# EAGLE design PS2 to UART revB (EAGLE 7.2.0)
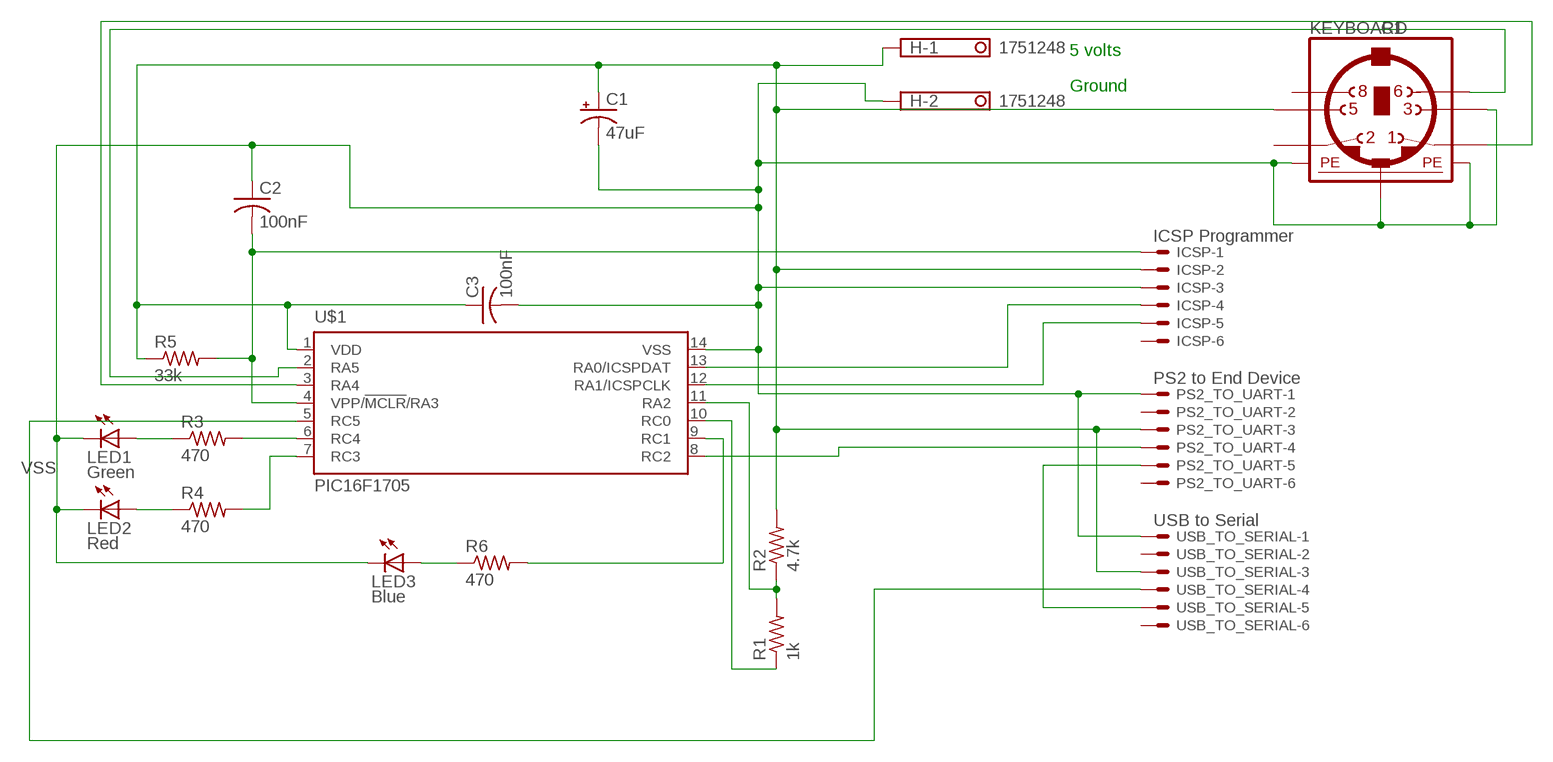
[diagram p0: schematic, sheet 1]

## Parts
C1  47uF  CPOL-USE2.5-7  [E2,5-7]
C2  100nF  C-US025-030X050  [C025-030X050]
C3  100nF  C-US025-030X050  [C025-030X050]
H  1751248  [1751248]
ICSP  ICSP Programmer  22-23-2061  [22-23-2061]
KEYBOARD  C1  MINI_DIN_6  [M_DIN6]
LED1  Green  LED5MM  [LED5MM]
LED2  Red  LED5MM  [LED5MM]
LED3  Blue  LED5MM  [LED5MM]
PS2_TO_UART  PS2 to End Device  22-23-2061  [22-23-2061]
R1  1k  R-US_0207/10  [0207/10]
R2  4.7k  R-US_0207/10  [0207/10]
R3  470  R-US_0207/10  [0207/10]
R4  470  R-US_0207/10  [0207/10]
R5  33k  R-US_0207/12  [0207/12]
R6  470  R-US_0207/10  [0207/10]
U$1  PIC16F1705  [SO-14]
USB_TO_SERIAL  USB to Serial  22-23-2061  [22-23-2061]

## Nets
N$1: R1.2 R2.1 U$1.11(RA2)
N$2: R1.1 U$1.10(RC0)
N$3: R3.2 U$1.6(RC4)
N$4: R4.2 U$1.7(RC3)
N$5: LED1.A R3.1
N$6: LED2.A R4.1
N$7: U$1.5(RC5) USB_TO_SERIAL.4
N$8: PS2_TO_UART.4 U$1.8(RC2)
N$9: C2.2 ICSP.1 R5.2 U$1.4(VPP/!MCLR!/RA3)
N$10: ICSP.4 U$1.13(RA0/ICSPDAT)
N$11: ICSP.5 U$1.12(RA1/ICSPCLK)
N$12: PS2_TO_UART.5 USB_TO_SERIAL.5
N$14: LED3.A R6.1
N$15: R6.2 U$1.9(RC1)
N$16: KEYBOARD.1 U$1.3(RA4)
N$17: KEYBOARD.6 U$1.2(RA5)
VDD: C1.+ C3.1 H.1 ICSP.2 KEYBOARD.5 PS2_TO_UART.3 R2.2 R5.1 U$1.1(VDD) USB_TO_SERIAL.3
VSS: C1.- C2.1 C3.2 H.2 ICSP.3 KEYBOARD.3 KEYBOARD.SH1(PE1) KEYBOARD.SH2(PE2) KEYBOARD.SH3(PE3) LED1.K(C) LED2.K(C) LED3.K(C) PS2_TO_UART.1 U$1.14(VSS) USB_TO_SERIAL.1
Unconnected: ICSP.6 KEYBOARD.2 KEYBOARD.8 PS2_TO_UART.2 PS2_TO_UART.6 USB_TO_SERIAL.2 USB_TO_SERIAL.6

## Notes on the sheet
- 5 volts
- Ground

## Library data of the parts
C1 = rcl:CPOL-US: POLARIZED CAPACITOR, American symbol
C2 C3 = rcl:C-US: CAPACITOR, American symbol
H = con-phoenix-350:1751248: MKDS 1/ 2-3,5 Printklemme Nennstrom: 10 A Bemessungsspannung: 160 V Raster: 3,5 mm Polzahl: 2 Montageart: Löten Anschlussart: Schraubanschluss Anschlussrichtung vom Leiter zur Platine: 0° Source: http://eshop.phoenixcontact.com .. 1751248.pdf; OC_FARNELL: unknown; OC_NEWARK: unknown
ICSP PS2_TO_UART USB_TO_SERIAL = con-molex:22-23-2061: .100" (2.54mm) Center Header - 6 Pin; MF: MOLEX; MPN: 22-23-2061; OC_FARNELL: 1462922; OC_NEWARK: 27C1933
KEYBOARD = mini_din:MINI_DIN_6
LED1-LED3 = led:LED: LED OSRAM: - CHIPLED LG R971, LG N971, LY N971, LG Q971, LY Q971, LO R971, LY R971 LH N974, LH R974 LS Q976, LO Q976, LY Q976 LO Q996 - Hyper CHIPLED LW Q18S LB Q993, LB Q99A, LB R99A - SideLED LS A670, LO A670, LY A670, LG A670, LP A670 LB A673, LV A673, LT A673, LW A673 LH A674 LY A675 LS A676, LA A676, LO A676, LY A676, LW A676 LS A679, LY A679, LG A679 - Hyper Micro SIDELED® LS Y876, LA Y876, LO Y876, LY Y876 LT Y87S - SmartLED LW L88C, LW L88S LB L89C, LB L89S, LG L890 LS L89K, LO L89K, LY L89K LS L896, LA L896, LO L896, LY L896 - TOPLED LS T670, LO T670, LY T670, LG T670, LP T670 LSG T670, LSP T670, LSY T670, LOP T670, LYG T670 LG T671, LOG T671, LSG T671 LB T673, LV T673, LT T673, LW T673 LH T674 LS T676, LA T676, LO T676, LY T676, LB T676, LH T676, LSB T676, LW T676 LB T67C, LV T67C, LT T67C, LS T67K, LO T67K, LY T67K, LW E67C LS E67B, LA E67B, LO E67B, LY E67B, LB E67C, LV E67C, LT E67C LW T67C LS T679, LY T679, LG T679 LS T770, LO T770, LY T770, LG T770, LP T770 LB T773, LV T773, LT T773, LW T773 LH T774 LS E675, LA E675, LY E675, LS T675 LS T776, LA T776, LO T776, LY T776, LB T776 LHGB T686 LT T68C, LB T68C - Hyper Mini TOPLED® LB M676 - Mini TOPLED Santana® LG M470 LS M47K, LO M47K, LY M47K Source: http://www.osram.convergy.de LUXEON: - LUMILED® LXK2-PW12-R00, LXK2-PW12-S00, LXK2-PW14-U00, LXK2-PW14-V00 LXK2-PM12-R00, LXK2-PM12-S00, LXK2-PM14-U00 LXK2-PE12-Q00, LXK2-PE12-R00, LXK2-PE12-S00, LXK2-PE14-T00, LXK2-PE14-U00 LXK2-PB12-K00, LXK2-PB12-L00, LXK2-PB12-M00, LXK2-PB14-N00, LXK2-PB14-P00, LXK2-PB14-Q00 LXK2-PR12-L00, LXK2-PR12-M00, LXK2-PR14-Q00, LXK2-PR14-R00 LXK2-PD12-Q00, LXK2-PD12-R00, LXK2-PD12-S00 LXK2-PH12-R00, LXK2-PH12-S00 LXK2-PL12-P00, LXK2-PL12-Q00, LXK2-PL12-R00 Source: www.luxeon.com KINGBRIGHT: KA-3528ASYC Source: www.kingbright.com
R1-R4 R6 = rcl:R-US_: RESISTOR, American symbol
R5 = resistor:R-US_: RESISTOR, American symbol
U$1 = microchip:PIC16F1705: Cost Effective 8-Bit Intelligent Analog Flash Microcontrollers

## Board
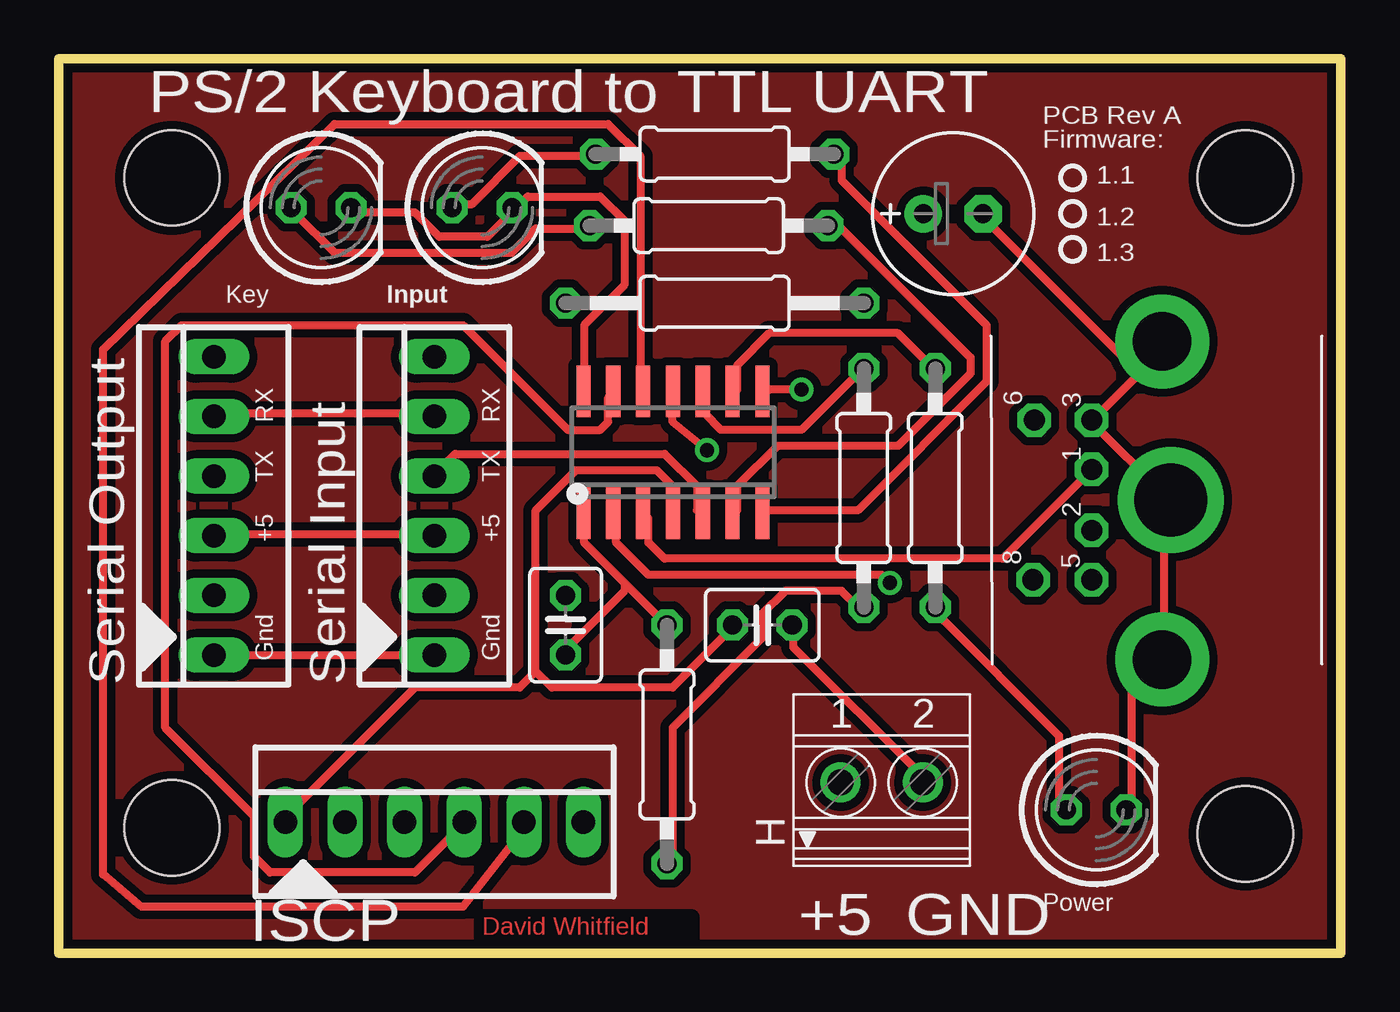
[diagram p1: board, top side]
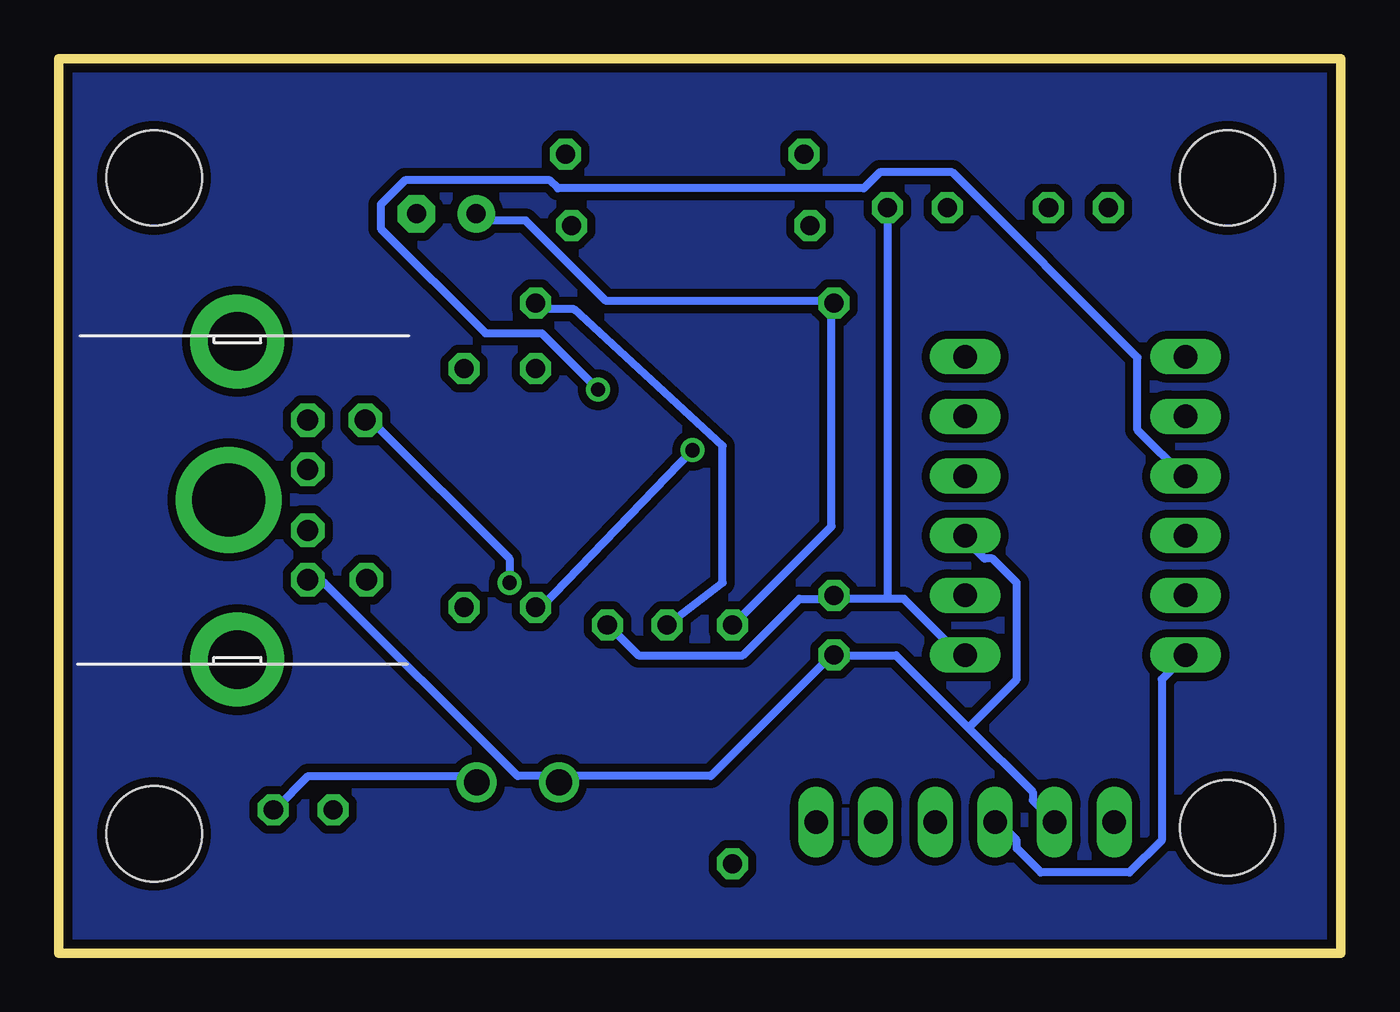
[diagram p2: board, bottom side, seen from below]

Size 54.61 x 38.1 mm. Coordinates in mm from the lower left corner, seen from the top.
Outline: 0,0 0,38.1 54.61,38.1 54.61,0 0,0
Copper layers (1*16): Top 0.035mm / dielectric 1.5mm / Bottom 0.035mm
Design rules "default *": minimum track width 13mil, minimum drill 24mil, track to track 14mil, track to pad 14mil, pad to pad 14mil, via to via 14mil, smd to smd 14mil, copper to edge 15mil, drill to drill 8mil, minimum pad ring 10mil, minimum via ring 8mil, stop-mask expansion 4mil, vias tented up to drill 0mil, thermal gap 10mil
Holes 4.06 mm at 4.83,33.02 4.83,5.33 50.55,33.02 50.55,5.08

### Footprints (pad centres in the part's own frame; a part is rotated, then mirrored left to right if it is on the bottom)
E2,5-7 = drill 0.813 pad 1.6: + -1.27,0 | drill 0.813 pad 1.6 octagon: - 1.27,0
C025-030X050 = drill 0.813 octagon: 1 -1.27,0; 2 1.27,0
1751248 = drill 1.1 pad 1.7: 1 -1.75,-0.1; 2 1.75,-0.1
22-23-2061 = drill 1 long: 1 -6.35,0; 2 -3.81,0; 3 -1.27,0; 4 1.27,0; 5 3.81,0; 6 6.35,0
M_DIN6 = drill 0.9 pad 1.422 octagon: 1 -1.3,-3.75; 2 1.3,-3.75; 3 -3.4,-3.75; 5 3.4,-3.75; 6 -3.4,-6.2; 8 3.4,-6.25 | drill 2.5 pad 4: SH1 6.8,-0.75; SH3 -6.75,-0.75 | drill 3.1 pad 4.5: SH2 0,-0.381
LED5MM = drill 0.813 octagon: A -1.27,0; K 1.27,0
0207/10 = drill 0.813 octagon: 1 -5.08,0; 2 5.08,0
0207/12 = drill 0.813 octagon: 1 -6.35,0; 2 6.35,0
SO-14 = smd 0.6 x 2.2: 1 -3.81,-2.6; 2 -2.54,-2.6; 3 -1.27,-2.6; 4 0,-2.6; 5 1.27,-2.6; 6 2.54,-2.6; 7 3.81,-2.6; 8 3.81,2.6; 9 2.54,2.6; 10 1.27,2.6; 11 0,2.6; 12 -1.27,2.6; 13 -2.54,2.6; 14 -3.81,2.6

### Placement (x,y rotation side)
C1  38.1,31.5 0 top
C2  29.97,13.97 180 top
C3  21.59,13.97 90 top
H  35.05,7.37 0 top
ICSP  16,5.59 0 top
KEYBOARD  47.75,19.3 270 top
LED1  11.18,31.75 0 top
LED2  18.03,31.75 0 top
LED3  44.2,6.1 0 top
PS2_TO_UART  6.6,19.05 90 top
R1  34.29,19.81 270 top
R2  25.91,8.89 90 top
R3  27.69,30.99 0 top
R4  27.94,34.04 0 top
R5  27.94,27.69 0 top
R6  37.34,19.81 90 top
U$1  26.16,21.34 0 top
USB_TO_SERIAL  16,19.05 90 top

### Tracks (layer width: path | path; a pad name or v marks a point on that pad's centre or on a via)
N$1  (via drill 0.61)
  Top 0.33: v27.61,21.43 26.15,22.63 26.15,23.66 U$1.11 | R2.1 26.15,4.12 26.15,9.6 29.92,13.37 29.92,14.4 30.95,15.43 33.35,15.43 34.04,14.74 R1.2
  Bottom 0.33: v27.61,21.43 34.04,14.74 R1.2
N$2
  Top 0.33: U$1.10 27.52,23.66 27.52,22.97 28.21,22.29 31.64,22.29 34.04,24.69 R1.1
N$3
  Top 0.33: U$1.6 28.89,18.86 28.89,19.89 30.61,21.6 35.75,21.6 38.84,24.69 38.84,25.38 33.01,31.2 R3.2
N$4
  Top 0.33: U$1.7 30.26,18.86 34.04,18.86 39.52,24.35 39.52,26.75 33.35,32.92 33.35,33.95 R4.2
N$5
  Top 0.33: R3.1 22.38,30.86 20.32,30.86 19.29,29.83 11.75,29.83 10.03,31.55 LED1.A
N$6
  Top 0.33: LED2.A 16.89,31.89 17.58,31.89 19.63,33.95 22.72,33.95 R4.1
N$7
  Top 0.33: U$1.5 27.18,18.86 27.18,19.89 25.81,21.26 16.89,21.26 16.2,20.57 USB_TO_SERIAL.4
N$8  (via drill 0.61)
  Top 0.33: v31.64,24 30.26,24 U$1.8
  Bottom 0.33: v31.64,24 34.04,26.4 36.44,26.4 40.89,30.86 40.89,31.89 39.87,32.92 33.69,32.92 33.35,32.58 20.32,32.58 19.63,33.26 16.55,33.26 8.66,25.38 8.66,22.29 6.6,20.23 PS2_TO_UART.4
N$9
  Top 0.33: 20.32,12 20.32,18.86 22.03,20.57 25.46,20.57 26.15,19.89 26.15,18.86 U$1.4 | 20.32,12 21.01,11.32 26.15,11.32 28.55,13.72 C2.2 | 20.32,12 19.63,11.32 15.18,11.32 9.69,5.83 ICSP.1
  Bottom 0.33: R5.2 34.04,27.43 32.66,27.43 26.33,21.6 26.33,15.77 28.55,14.06 C2.2
N$10
  Top 0.33: U$1.13 23.41,23.66 23.41,22.63 23.06,22.29 21.69,22.29 17.23,26.75 5.23,26.75 4.55,26.06 4.55,9.6 8.32,5.83 8.32,4.12 9,3.43 15.18,3.43 17.23,5.49 ICSP.4
N$11
  Top 0.33: U$1.12 24.78,24 24.78,33.95 23.41,35.32 11.75,35.32 1.89,25.72 1.89,3.35 3.52,1.98 17.23,1.98 19.98,5.49 ICSP.5
N$12
  Top 0.33: PS2_TO_UART.5 6.6,22.97 15.86,22.97 USB_TO_SERIAL.5
N$13
  pour Top: 0,0 0,38.1 54.61,38.1 54.61,0
N$14
  Top 0.33: LED3.A 42.61,6.17 42.61,9.26 37.47,14.4 R6.1
N$15
  Top 0.33: U$1.9 28.89,24 28.89,25.03 30.26,26.4 35.75,26.4 37.12,25.03 R6.2
N$16
  Top 0.33: U$1.3 25.12,18.52 25.12,17.49 25.81,16.8 40.21,16.8 43.98,20.57 KEYBOARD.1
N$17  (via drill 0.61)
  Top 0.33: v35.41,15.77 35.07,16.12 25.12,16.12 23.75,17.49 23.75,18.52 U$1.2
  Bottom 0.33: v35.41,15.77 35.41,16.8 41.24,22.63 KEYBOARD.6
N$18
  pour Bottom: 0,38.1 54.61,38.1 54.61,0 0,0
VDD
  Top 0.33: PS2_TO_UART.3 6.6,17.83 15.86,17.83 USB_TO_SERIAL.3 | 24.09,15.77 25.81,14.06 R2.2 | 24.09,15.77 22.38,17.49 22.38,18.52 U$1.1 | 24.09,15.77 24.09,15.43 21.69,13.03 C3.1
  Bottom 0.33: KEYBOARD.5 43.98,15.77 43.29,15.77 35.07,7.54 33.35,7.54 H.1 33.01,7.54 26.83,7.54 21.69,12.69 C3.1 21.35,12.69 18.95,12.69 15.86,9.6 | R2.2 25.81,14.06 21.69,18.17 21.69,27.43 R5.1 21.69,27.77 31.29,27.77 34.72,31.2 36.78,31.2 C1.+ | ICSP.2 13.12,6.51 13.12,6.86 15.86,9.6 | 15.86,9.6 13.8,11.66 13.8,15.77 14.83,16.8 15.18,16.8 15.86,17.49 USB_TO_SERIAL.3
VSS
  Top 0.33: U$1.14 22.38,24 22.38,26.75 24.09,28.46 24.09,31.2 23.06,32.23 19.98,32.23 19.63,31.89 LED2.K 19.29,31.55 18.26,30.52 16.2,30.52 15.18,31.55 12.78,31.55 LED1.K | PS2_TO_UART.1 6.6,12.69 15.86,12.69 USB_TO_SERIAL.1 | C2.1 31.29,13.72 31.29,13.03 36.78,7.54 H.2 | LED3.K 45.7,6.17 45.7,11.32 46.72,12.34 KEYBOARD.SH1 47.07,12.69 47.07,19.2 KEYBOARD.SH2 47.07,19.55 43.98,22.63 KEYBOARD.3 44.32,22.97 46.04,24.69 | 46.04,24.69 47.07,25.72 KEYBOARD.SH3 46.04,24.69 | 46.04,24.69 39.52,31.2 C1.-
  Bottom 0.33: 19.29,15.09 18.61,15.09 16.2,12.69 USB_TO_SERIAL.1 | 19.29,15.09 21.35,15.09 C3.2 21.69,15.09 23.06,15.09 25.46,12.69 29.92,12.69 30.95,13.72 C2.1 | ICSP.3 14.49,5.49 13.8,4.8 13.8,4.46 12.78,3.43 9,3.43 7.63,4.8 7.63,11.66 6.6,12.69 PS2_TO_UART.1 | 19.29,15.09 19.29,31.55 LED2.K | H.2 37.12,7.54 43.98,7.54 45.35,6.17 LED3.K

### Text on the board
Top: David Whitfield
tPlace: PS/2 Keyboard to TTL UART | PCB Rev A | Firmware: | 1.1 | 1.2 | 1.3 | Key | Input | RX | RX | TX | TX | +5 | +5 | Gnd | Gnd | Serial Output | Serial Input | Power | ISCP | +5 | GND